# EAGLE design ledbar-shield (EAGLE 5.11)
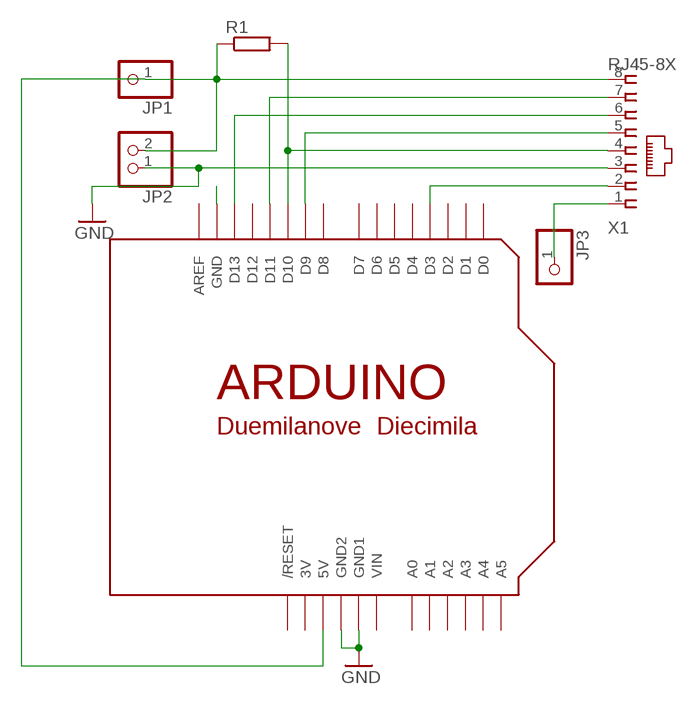
[diagram p0: schematic, sheet 1]

## Parts
JP1  PINHD-1X1  [1X01]
JP2  PINHD-1X2  [1X02]
JP3  PINHD-1X1  [1X01]
R1  R-EU_0207/10  [0207/10]
U$1  ARDUINO-NOHOLE  [ARDUINO-NOHOLE]
X1  RJ45-8X  [RJ45-NO-SHIELD]

## Nets
GND: JP2.1 U$1.GND1 U$1.GND2 X1.3
N$2: JP1.1 JP2.2 R1.1 U$1.5V X1.8
N$3: U$1.D11 X1.7
N$4: U$1.D13 X1.6
N$5: U$1.D9 X1.5
N$6: R1.2 U$1.D10 X1.4
N$7: U$1.D3 X1.2
N$8: JP3.1 X1.1
N$9: U$1.GND
Unconnected: U$1.A0 U$1.A1 U$1.A2 U$1.A3 U$1.A4 U$1.A5 U$1.AREF U$1.D0 U$1.D1 U$1.D2 U$1.D4 U$1.D5 U$1.D6 U$1.D7 U$1.D8 U$1.D12 U$1.RESET(/RESET)

## Power pins joined to a net without a drawn wire
3V: U$1.3V
VIN: U$1.VIN

## Library data of the parts
JP1 JP3 = adafruit:PINHD-1X1: Pin header 1x1 for 0.1" spacing With round pins
JP2 = pinhead:PINHD-1X2: PIN HEADER
R1 = rcl:R-EU_: RESISTOR, European symbol
U$1 = adafruit:ARDUINO: Arduino Diecimila/Duemilanove Make a shield with ease, this package has all the named pins as well as the two mounting drill holes and an outline of the USB and DC power connector. The outline is on the DIMENSION layer, so if your board house uses it they will cut the outline to match. http://www.ladyada.net/library/pcb/eaglelibrary.html
X1 = con-tycoelectronics:RJ45: CORCOM Modular RJ Jacks No Shield Source: www.tycoelectronics.com .. ENG_DS_1654001_1099_RJ_L_0507.pdf; MPN: RJ45-8X; OC_FARNELL: unknown; OC_NEWARK: 16R6101

## Board
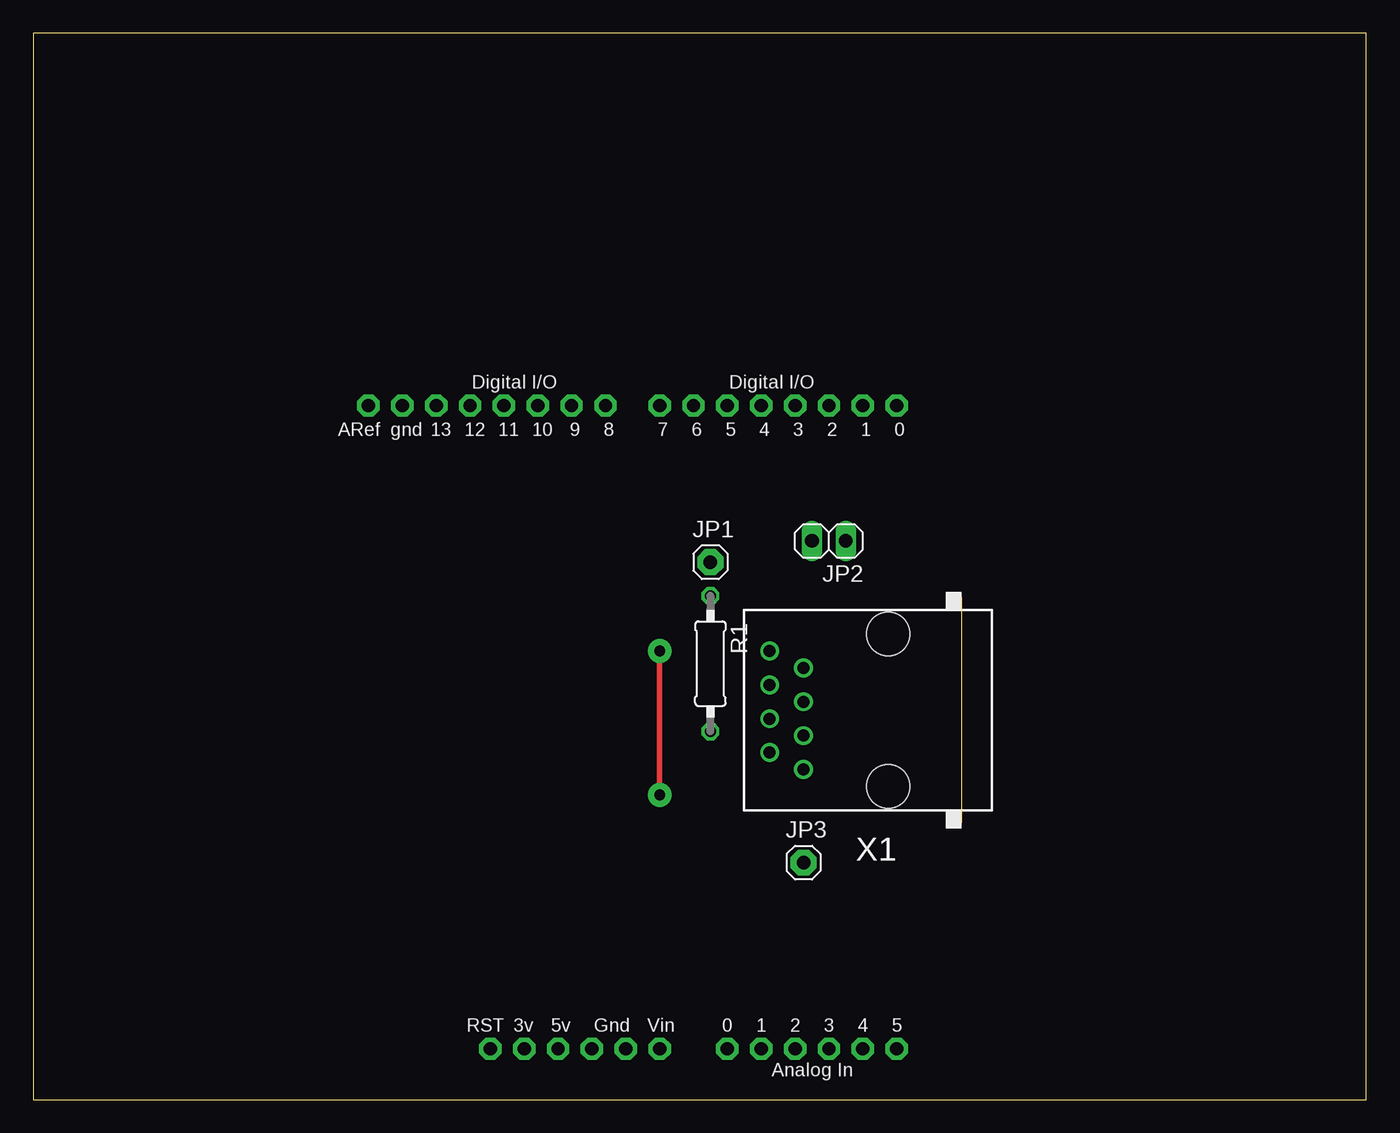
[diagram p1: board, top side]
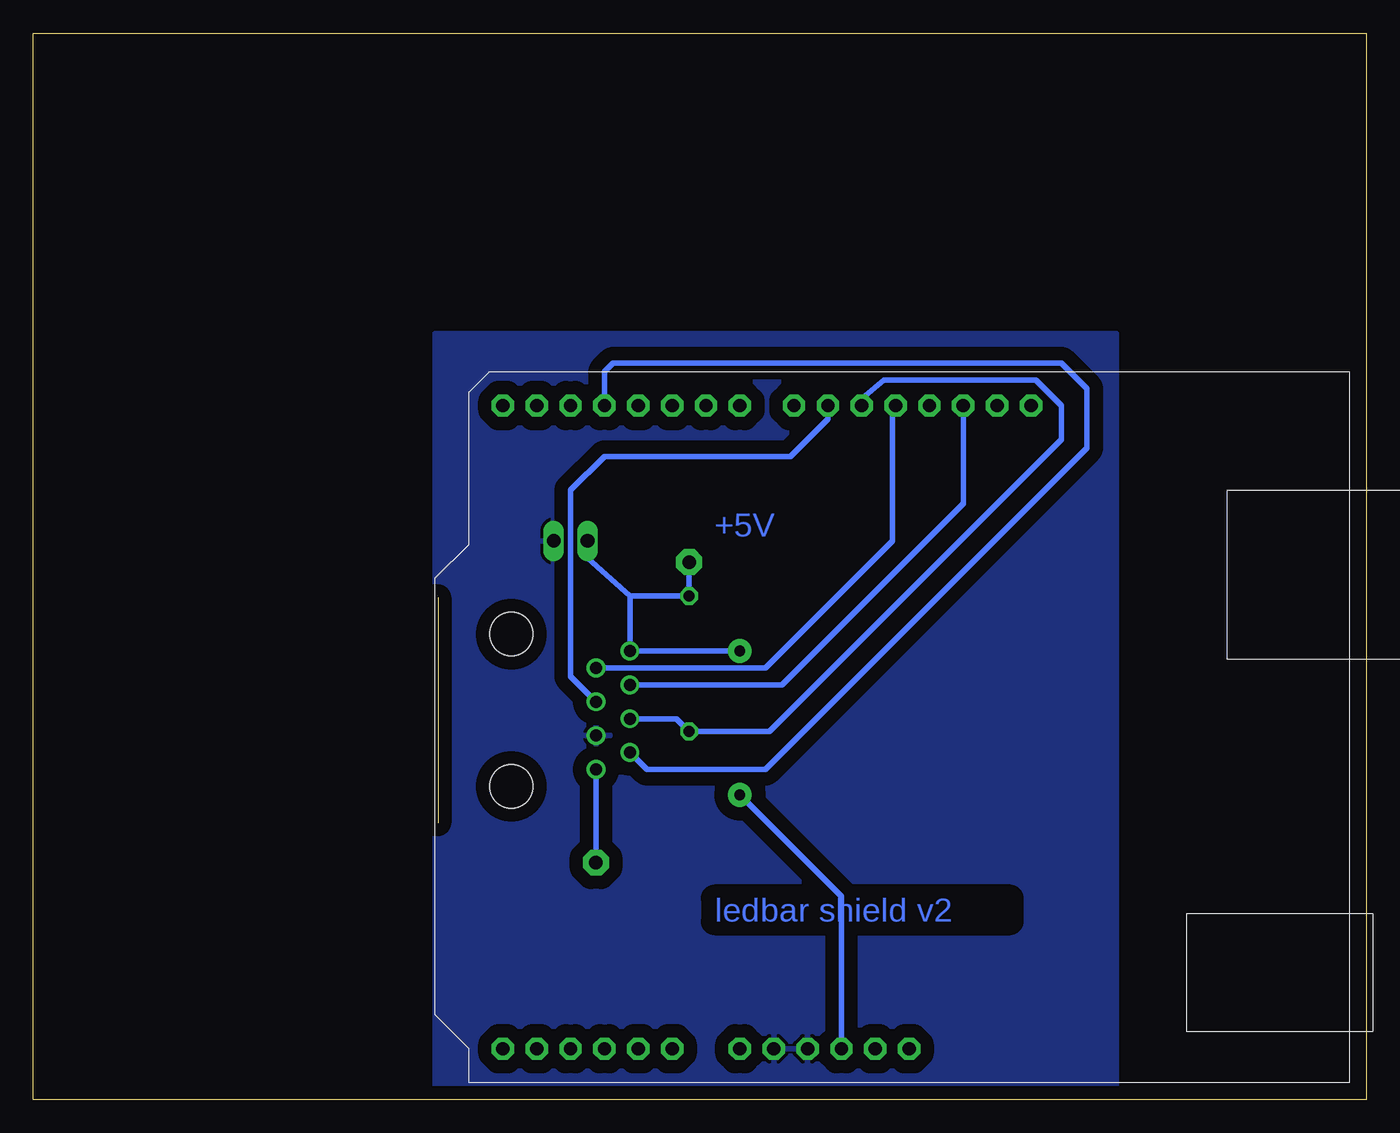
[diagram p2: board, bottom side, seen from below]

Size 100 x 80 mm. Coordinates in mm from the lower left corner, seen from the top.
Outline: 0,0 100,0 100,80 0,80 0,0
Copper layers (1*16): Top 0.035mm / dielectric 1.5mm / Bottom 0.035mm
Design rules "default *": minimum track width 10mil, minimum drill 0.8mm, track to track 8mil, track to pad 8mil, pad to pad 8mil, via to via 8mil, smd to smd 8mil, copper to edge 40mil, drill to drill 8mil, minimum pad ring 10mil, minimum via ring 8mil, stop-mask expansion 4mil, vias tented up to drill 0mil, thermal gap 10mil

### Footprints (pad centres in the part's own frame; a part is rotated, then mirrored left to right if it is on the bottom)
1X01 = drill 1.016 pad 1.93 octagon: 1 0,0
1X02 = drill 1.016 long: 1 -1.27,0; 2 1.27,0
0207/10 = drill 0.813 octagon: 1 -5.08,0; 2 5.08,0
ARDUINO-NOHOLE = drill 1 pad 1.676 octagon: 3V 35.56,2.54; 5V 38.1,2.54; A0 50.8,2.54; A1 53.34,2.54; A2 55.88,2.54; A3 58.42,2.54; A4 60.96,2.54; A5 63.5,2.54; AREF 23.876,50.8; D0 63.5,50.8; D1 60.96,50.8; D2 58.42,50.8; D3 55.88,50.8; D4 53.34,50.8; D5 50.8,50.8; D6 48.26,50.8; D7 45.72,50.8; D8 41.656,50.8; D9 39.116,50.8; D10 36.576,50.8; D11 34.036,50.8; D12 31.496,50.8; D13 28.956,50.8; GND 26.416,50.8; GND1 43.18,2.54; GND2 40.64,2.54; RESET 33.02,2.54; VIN 45.72,2.54
RJ45-NO-SHIELD = drill 0.9 pad 1.4 round: 1 -4.445,6.35; 2 -3.175,8.89; 3 -1.905,6.35; 4 -0.635,8.89; 5 0.635,6.35; 6 1.905,8.89; 7 3.175,6.35; 8 4.445,8.89 | hole 3.251: -5.715,0; 5.715,0

### Placement (x,y rotation side)
JP1  50.8,40.32 0 top
JP2  59.69,41.91 180 top
JP3  57.78,17.78 0 top
R1  50.8,32.7 270 top
U$1  1.27,1.27 0 top
X1  64.14,29.21 90 top

### Tracks (layer width: path | path; a pad name or v marks a point on that pad's centre or on a via)
GND
  pour Bottom (isolate 1.016): 69.85,57.47 69.85,-0.64 18.73,-0.64 18.73,57.47
N$2  (via drill 0.8 pad 1.78)
  Top 0.406: v46.99,22.86 v46.99,33.66
  Bottom 0.406: 55.24,37.78 X1.8 v46.99,33.66 | 55.24,37.78 R1.1 JP1.1 | 55.24,37.78 58.42,40.64 JP2.2 | v46.99,22.86 39.37,15.24 U$1.5V
N$3
  Bottom 0.406: X1.7 45.09,32.38 35.56,41.91 35.56,51.82 U$1.D11
N$4
  Bottom 0.406: U$1.D13 30.23,44.7 43.81,31.11 X1.6
N$5
  Bottom 0.406: X1.5 59.69,31.75 59.69,45.72 57.15,48.26 43.18,48.26 40.39,51.05 U$1.D9
N$6
  Bottom 0.406: X1.4 51.75,28.57 R1.2 44.77,27.62 22.86,49.53 22.86,52.07 24.77,53.98 36.2,53.98 37.78,52.64 U$1.D10
N$7
  Bottom 0.406: X1.2 53.98,24.77 45.09,24.77 20.95,48.9 20.95,53.34 22.86,55.24 56.52,55.24 57.15,54.61 U$1.D3
N$8
  Bottom 0.406: JP3.1 X1.1

### Text on the board
Bottom: +5V | ledbar shield v2